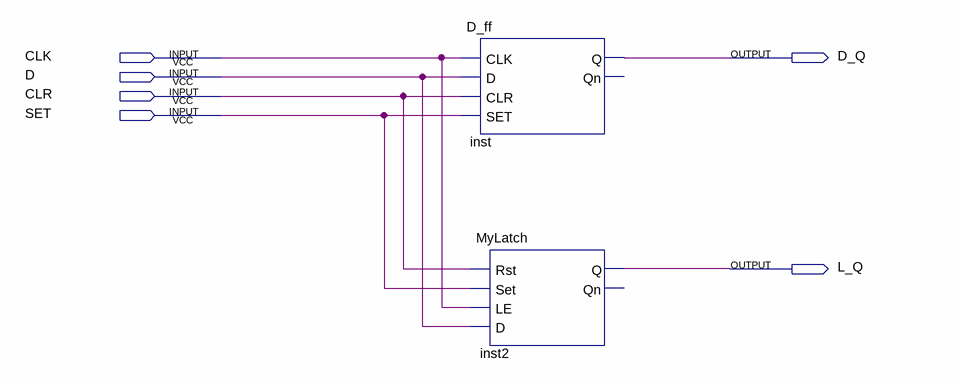
[diagram p0: schematic sheet]
// Quartus schematic Dff_Latchbdf.bdf as structural Verilog: 2 symbols, 6 pins
module Dff_Latchbdf (
  input  CLK,
  input  D,
  input  CLR,
  input  SET,
  output D_Q,
  output L_Q
);

  D_ff inst (.CLK(CLK), .D(D), .CLR(CLR), .SET(SET), .Q(D_Q));  // open: Qn
  MyLatch inst2 (.Rst(CLR), .Set(SET), .LE(CLK), .D(D), .Q(L_Q));  // open: Qn
endmodule
